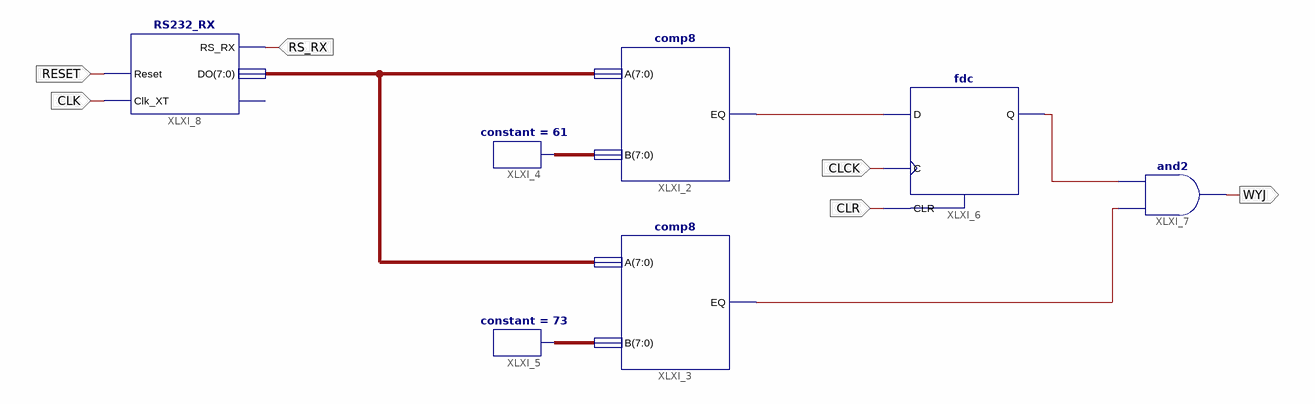
[diagram p0: schematic sheet 1]
// Xilinx ISE schematic scheme_keyboard.sch (xc9500xl) as structural Verilog: 7 symbols, 6 ports
module scheme_keyboard (
  input  CLCK,
  input  CLR,
  input  CLK,
  input  RESET,
  input  RS_RX,
  output WYJ
);

  wire XLXN_7, XLXN_8, XLXN_9;
  wire [7:0] WEJ, XLXN_1, XLXN_2;

  comp8 XLXI_2 (.A(WEJ), .B(XLXN_2), .EQ(XLXN_7));
  constant #(.CValue("61")) XLXI_4 (.O(XLXN_2));
  comp8 XLXI_3 (.A(WEJ), .B(XLXN_1), .EQ(XLXN_8));
  constant #(.CValue("73")) XLXI_5 (.O(XLXN_1));
  and XLXI_7 (WYJ, XLXN_8, XLXN_9);
  fdc XLXI_6 (.C(CLCK), .CLR(CLR), .D(XLXN_7), .Q(XLXN_9));
  RS232_RX XLXI_8 (.Reset(RESET), .Clk_XT(CLK), .DO(WEJ), .RS_RX(RS_RX));  // open: Rdy
endmodule
